# EAGLE design R3D2 (EAGLE 7.4.0)
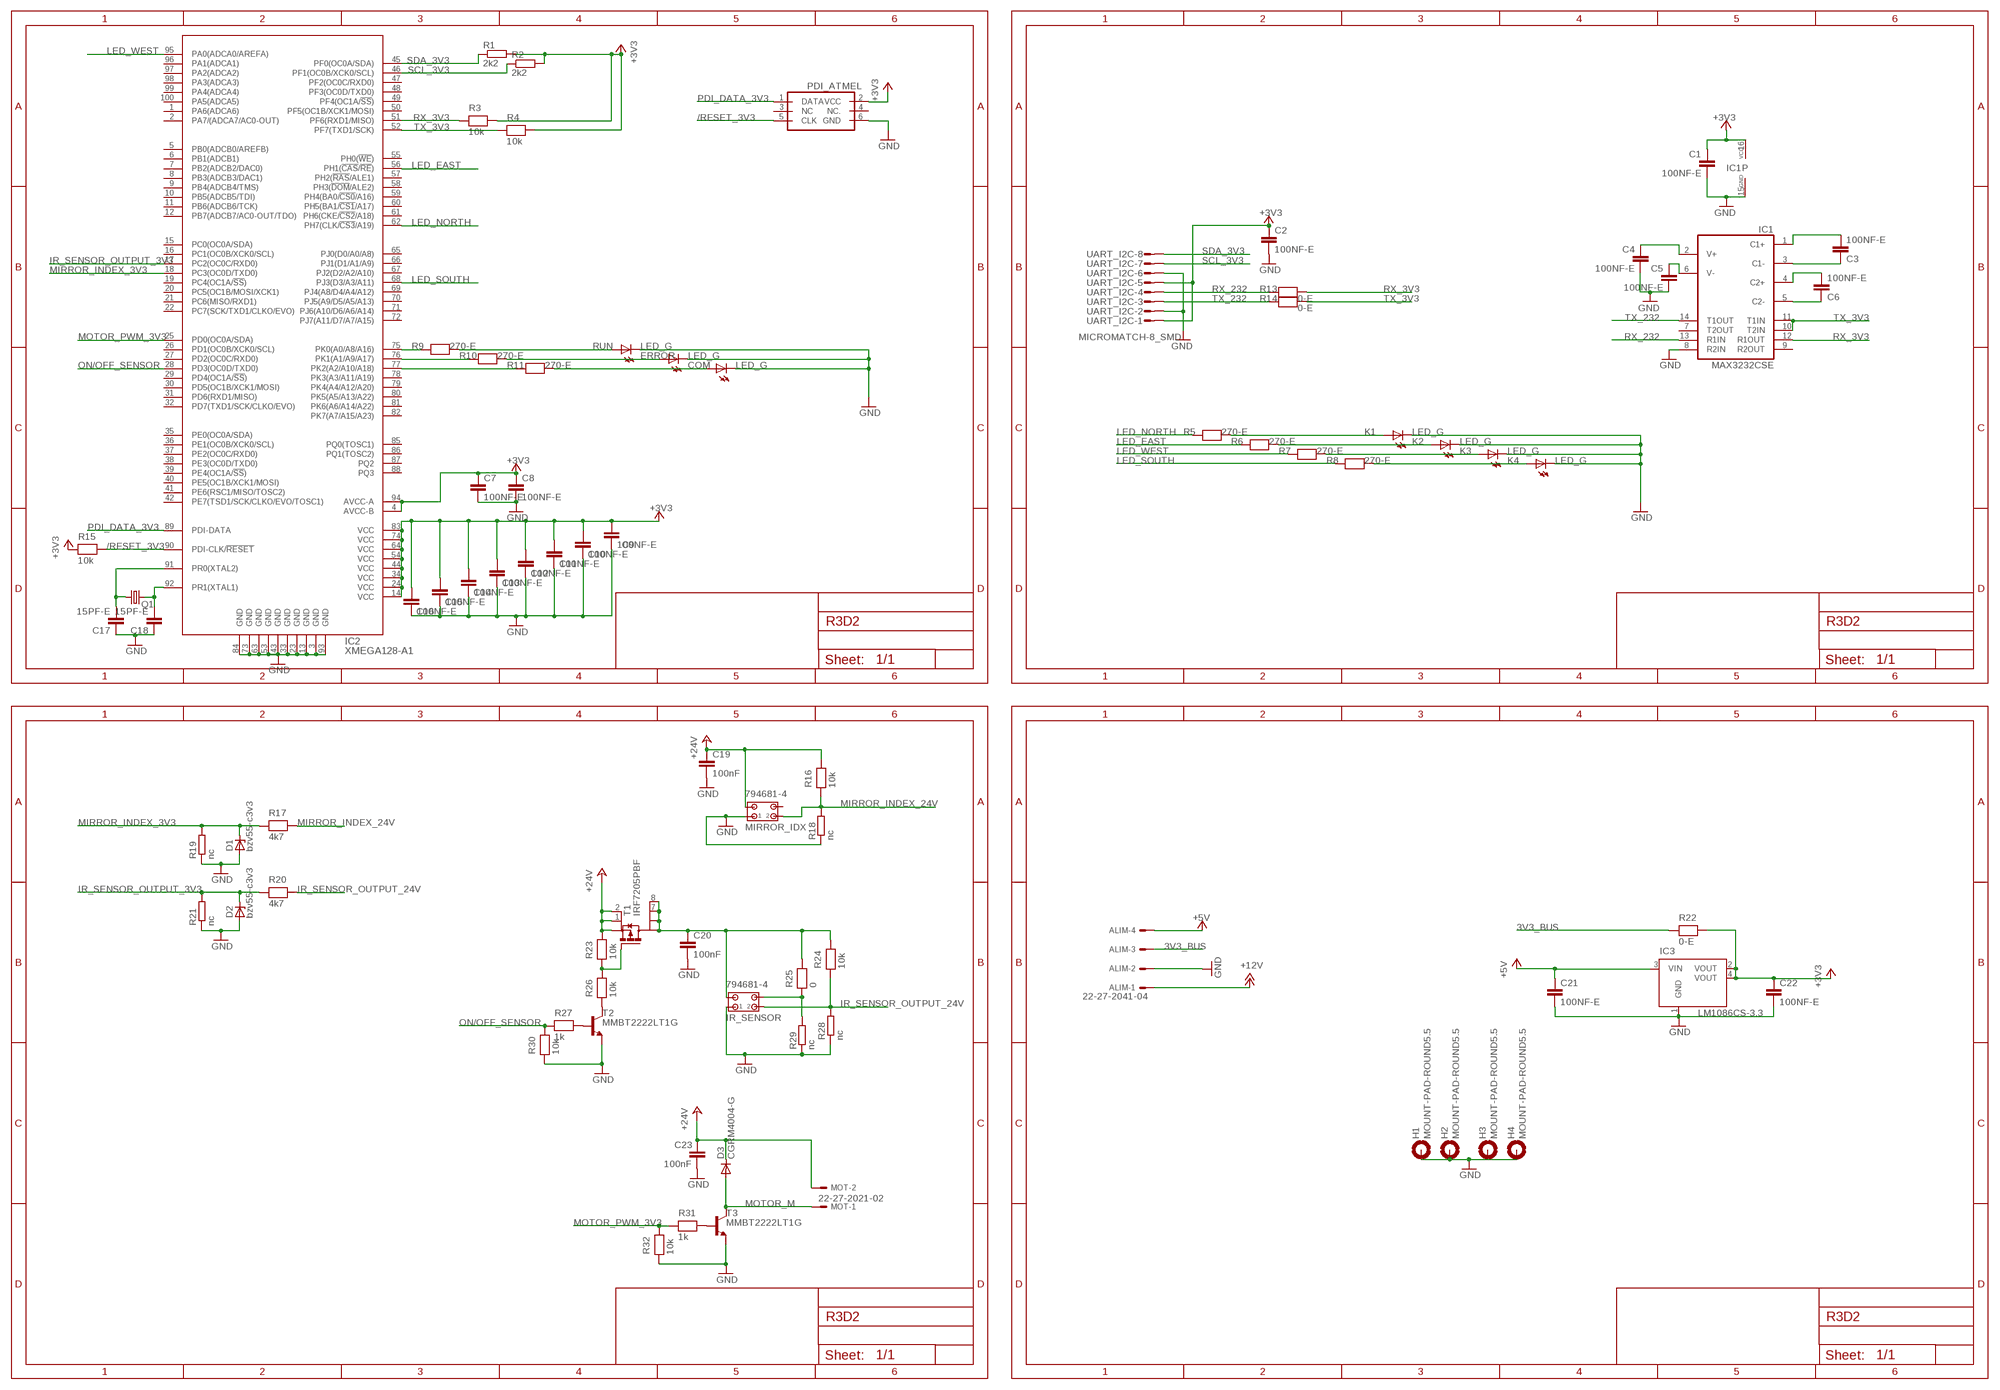
[diagram p0: schematic, sheet 1]

## Parts
ALIM  22-27-2041-04  [6410-04]
C1  100NF-E  [C0805]
C2  100NF-E  [C0805]
C3  100NF-E  [C0805]
C4  100NF-E  [C0805]
C5  100NF-E  [C0805]
C6  100NF-E  [C0805]
C7  100NF-E  [C0805]
C8  100NF-E  [C0805]
C9  100NF-E  [C0805]
C10  100NF-E  [C0805]
C11  100NF-E  [C0805]
C12  100NF-E  [C0805]
C13  100NF-E  [C0805]
C14  100NF-E  [C0805]
C15  100NF-E  [C0805]
C16  100NF-E  [C0805]
C17  15PF-E  [C0805]
C18  15PF-E  [C0805]
C19  100nF  100NF-E  [C0805]
C20  100nF  100NF-F  [C0603]
C21  100NF-E  [C0805]
C22  100NF-E  [C0805]
C23  100nF  100NF-E  [C0805]
COM  LED_G  [CHIP-LED0805]
D1  bzv55-c3v3  BZV55-C3V3SOD80C  [SOD80C]
D2  bzv55-c3v3  BZV55-C3V3SOD80C  [SOD80C]
D3  CGRM4004-G  [SOD-123_MINI-SMA]
ERROR  LED_G  [CHIP-LED0805]
H1  MOUNT-PAD-ROUND5.5  [5,5-PAD]
H2  MOUNT-PAD-ROUND5.5  [5,5-PAD]
H3  MOUNT-PAD-ROUND5.5  [5,5-PAD]
H4  MOUNT-PAD-ROUND5.5  [5,5-PAD]
IC1  MAX3232CSE  [SO16]
IC2  XMEGA128-A1  XMEGA-A1TQFP  [TQFP100]
IC3  LM1086CS-3.3  [TO263]
IR_SENSOR  794681-4  [794681-4]
K1  LED_G  [CHIP-LED0805]
K2  LED_G  [CHIP-LED0805]
K3  LED_G  [CHIP-LED0805]
K4  LED_G  [CHIP-LED0805]
MIRROR_IDX  794681-4  [794681-4]
MOT  22-27-2021-02  [6410-02]
PDI_ATMEL  PDI_ATMEL  [ML6]
Q1  CRYSTAL_16MHZ_HC49UP  [HC49UP]
R1  2k2  R-EU_R0603  [R0603]
R2  2k2  R-EU_R0603  [R0603]
R3  10k  10K-F  [R0603]
R4  10k  10K-F  [R0603]
R5  270-E  [R0805]
R6  270-E  [R0805]
R7  270-E  [R0805]
R8  270-E  [R0805]
R9  270-E  [R0805]
R10  270-E  [R0805]
R11  270-E  [R0805]
R13  0-E  [R0805]
R14  0-E  [R0805]
R15  10k  10K-F  [R0603]
R16  10k  10K-F  [R0603]
R17  4k7  4K7-E  [R0805]
R18  nc  R-EU_R0805  [R0805]
R19  nc  R-EU_R0603  [R0603]
R20  4k7  4K7-E  [R0805]
R21  nc  R-EU_R0603  [R0603]
R22  0-E  [R0805]
R23  10k  10K-F  [R0603]
R24  10k  10K-F  [R0603]
R25  0  0-F  [R0603]
R26  10k  10K-F  [R0603]
R27  1k  1K-F  [R0603]
R28  nc  R-EU_R0603  [R0603]
R29  nc  R-EU_R0603  [R0603]
R30  10k  10K-F  [R0603]
R31  1k  1K-F  [R0603]
R32  10k  10K-F  [R0603]
RUN  LED_G  [CHIP-LED0805]
T1  IRF7205PBF  [SO8]
T2  MMBT2222LT1G  MMBT2222ALT1-NPN-SOT23-BEC  [SOT23-BEC]
T3  MMBT2222LT1G  MMBT2222ALT1-NPN-SOT23-BEC  [SOT23-BEC]
UART_I2C  MICROMATCH-8_SMD  [MICROMATCH-8_SMD]

## Nets
3V3_BUS: ALIM.3 R22.1
+3V3: C1.1 C2.1 C7.1 C8.1 C9.1 C10.1 C11.1 C12.1 C13.1 C14.1 C15.1 C16.1 C22.1 IC1.16(VCC) IC2.4(AVCC-B) IC2.14(VCC) IC2.24(VCC) IC2.34(VCC) IC2.44(VCC) IC2.54(VCC) IC2.64(VCC) IC2.74(VCC) IC2.83(VCC) IC2.94(AVCC-A) IC3.2(VOUT) IC3.4(VOUT) PDI_ATMEL.2(VCC) R1.2 R2.2 R3.2 R4.2 R15.1 R22.2 UART_I2C.1 UART_I2C.5
+5V: ALIM.4 C21.1 IC3.3(VIN)
+12V: ALIM.1
+24V: C19.1 C23.1 D3.C MIRROR_IDX.3 MOT.2 R16.2 R23.2 T1.1(S) T1.2(S) T1.3(S)
/RESET_3V3: IC2.90(PDI-CLK/!RESET) PDI_ATMEL.5(CLK) R15.2
GND: ALIM.2 C1.2 C2.2 C4.2 C5.2 C7.2 C8.2 C9.2 C10.2 C11.2 C12.2 C13.2 C14.2 C15.2 C16.2 C17.1 C18.1 C19.2 C20.2 C21.2 C22.2 C23.2 COM.C D1.A D2.A ERROR.C H1.B5,5(MOUNT) H2.B5,5(MOUNT) H3.B5,5(MOUNT) H4.B5,5(MOUNT) IC1.8(R2IN) IC1.15(GND) IC2.3(GND) IC2.13(GND) IC2.23(GND) IC2.33(GND) IC2.43(GND) IC2.53(GND) IC2.63(GND) IC2.73(GND) IC2.84(GND) IC2.93(GND) IC3.1(GND) IR_SENSOR.1 K1.C K2.C K3.C K4.C MIRROR_IDX.1 PDI_ATMEL.6(GND) R18.1 R19.1 R21.1 R28.1 R29.1 R30.1 R32.1 RUN.C T2.E T3.E UART_I2C.2 UART_I2C.6
IR_SENSOR_OUTPUT_3V3: D2.C IC2.17(PC2(OC0C/RXD0)) R20.1 R21.2
IR_SENSOR_OUTPUT_24V: IR_SENSOR.2 R20.2 R24.1 R28.2
LED_EAST: IC2.56(PH1(!CAS!/!RE!)) R6.1
LED_NORTH: IC2.62(PH7(CLK/!CS3!/A19)) R5.1
LED_SOUTH: IC2.68(PJ3(D3/A3/A11)) R8.1
LED_WEST: IC2.95(PA0(ADCA0/AREFA)) R7.1
MIRROR_INDEX_3V3: D1.C IC2.18(PC3(OC0D/TXD0)) R17.1 R19.2
MIRROR_INDEX_24V: MIRROR_IDX.2 R16.1 R17.2 R18.2
MOTOR_M: D3.A MOT.1 T3.C
MOTOR_PWM_3V3: IC2.25(PD0(OC0A/SDA)) R31.1 R32.2
N$1: C3.1 IC1.1(C1+)
N$2: R9.2 RUN.A
N$3: R31.2 T3.B
N$4: ERROR.A R10.2
N$5: C3.2 IC1.3(C1-)
N$6: C6.1 IC1.4(C2+)
N$7: COM.A R11.2
N$9: IC2.75(PK0(A0/A8/A16)) R9.1
N$10: IC2.76(PK1(A1/A9/A17)) R10.1
N$11: C4.1 IC1.2(V+)
N$12: IC2.77(PK2(A2/A10/A18)) R11.1
N$13: C5.1 IC1.6(V-)
N$24: C6.2 IC1.5(C2-)
N$45: C17.2 IC2.91(PR0(XTAL2)) Q1.1
N$46: C18.2 IC2.92(PR1(XTAL1)) Q1.2
N$91: K1.A R5.2
N$92: K2.A R6.2
N$93: K3.A R7.2
N$94: K4.A R8.2
N$113: R27.2 T2.B
N$125: C20.1 IR_SENSOR.3 R24.2 R25.2 T1.5(D) T1.6(D) T1.7(D) T1.8(D)
N$126: R26.1 T2.C
N$128: R23.1 R26.2 T1.4(G)
N$129: IR_SENSOR.4 R25.1 R29.2
ON/OFF_SENSOR: IC2.28(PD3(OC0D/TXD0)) R27.1 R30.2
PDI_DATA_3V3: IC2.89(PDI-DATA) PDI_ATMEL.1(DATA)
RX_3V3: IC1.12(R1OUT) IC2.51(PF6(RXD1/MISO)) R3.1 R13.2
RX_232: IC1.13(R1IN) R13.1 UART_I2C.4
SCL_3V3: IC2.46(PF1(OC0B/XCK0/SCL)) R2.1 UART_I2C.7
SDA_3V3: IC2.45(PF0(OC0A/SDA)) R1.1 UART_I2C.8
TX_3V3: IC1.10(T2IN) IC1.11(T1IN) IC2.52(PF7(TXD1/SCK)) R4.1 R14.2
TX_232: IC1.14(T1OUT) R14.1 UART_I2C.3
Unconnected: IC1.7(T2OUT) IC1.9(R2OUT) IC2.1(PA6(ADCA6)) IC2.2(PA7/(ADCA7/AC0-OUT)) IC2.5(PB0(ADCB0/AREFB)) IC2.6(PB1(ADCB1)) IC2.7(PB2(ADCB2/DAC0)) IC2.8(PB3(ADCB3/DAC1)) IC2.9(PB4(ADCB4/TMS)) IC2.10(PB5(ADCB5/TDI)) IC2.11(PB6(ADCB6/TCK)) IC2.12(PB7(ADCB7/AC0-OUT/TDO)) IC2.15(PC0(OC0A/SDA)) IC2.16(PC1(OC0B/XCK0/SCL)) IC2.19(PC4(OC1A/!SS!)) IC2.20(PC5(OC1B/MOSI/XCK1)) IC2.21(PC6(MISO/RXD1)) IC2.22(PC7(SCK/TXD1/CLKO/EVO)) IC2.26(PD1(OC0B/XCK0/SCL)) IC2.27(PD2(OC0C/RXD0)) IC2.29(PD4(OC1A/!SS!)) IC2.30(PD5(OC1B/XCK1/MOSI)) IC2.31(PD6(RXD1/MISO)) IC2.32(PD7(TXD1/SCK/CLKO/EVO)) IC2.35(PE0(OC0A/SDA)) IC2.36(PE1(OC0B/XCK0/SCL)) IC2.37(PE2(OC0C/RXD0)) IC2.38(PE3(OC0D/TXD0)) IC2.39(PE4(OC1A/!SS!)) IC2.40(PE5(OC1B/XCK1/MOSI)) IC2.41(PE6(RSC1/MISO/TOSC2)) IC2.42(PE7(TSD1/SCK/CLKO/EVO/TOSC1)) IC2.47(PF2(OC0C/RXD0)) IC2.48(PF3(OC0D/TXD0)) IC2.49(PF4(OC1A/!SS!)) IC2.50(PF5(OC1B/XCK1/MOSI)) IC2.55(PH0(!WE!)) IC2.57(PH2(!RAS!/ALE1)) IC2.58(PH3(!DOM!/ALE2)) IC2.59(PH4(BA0/!CS0!/A16)) IC2.60(PH5(BA1/!CS1!/A17)) IC2.61(PH6(CKE/!CS2!/A18)) IC2.65(PJ0(D0/A0/A8)) IC2.66(PJ1(D1/A1/A9)) IC2.67(PJ2(D2/A2/A10)) IC2.69(PJ4(A8/D4/A4/A12)) IC2.70(PJ5(A9/D5/A5/A13)) IC2.71(PJ6(A10/D6/A6/A14)) IC2.72(PJ7(A11/D7/A7/A15)) IC2.78(PK3(A3/A11/A19)) IC2.79(PK4(A4/A12/A20)) IC2.80(PK5(A5/A13/A22)) IC2.81(PK6(A6/A14/A22)) IC2.82(PK7(A7/A15/A23)) IC2.85(PQ0(TOSC1)) IC2.86(PQ1(TOSC2)) IC2.87(PQ2) IC2.88(PQ3) IC2.96(PA1(ADCA1)) IC2.97(PA2(ADCA2)) IC2.98(PA3(ADCA3)) IC2.99(PA4(ADCA4)) IC2.100(PA5(ADCA5)) MIRROR_IDX.4 PDI_ATMEL.3(NC) PDI_ATMEL.4(NC.)

## Library data of the parts
ALIM = robotter_connector:22-?-04: CONNECTOR wire to board 2.54 mm (.1 inch) pitch header; OC_FARNELL: unknown; OC_NEWARK: unknown
C1-C16 C19 C21-C23 = robotter_capacitor:100NF; MOUSER: 81-GRM40Y104Z50D; RS: 220-7966; VALUE: 100nF 50V
C17 C18 = robotter_capacitor:15PF; VALUE: 15pF_0603_100V
C20 = robotter_capacitor:100NF; MOUSER: 81-GRM188F51H104ZA01; RS: 723-5534; VALUE: 100nF 50V
COM ERROR K1-K4 RUN = robotter_diode:LED_; MOUSER: 859-LTST-C171GKT; RS: 692-0935; VALUE: GREEN
D1 D2 = robotter_diode:BZV55-C3V3: Z-Diode; MOUSER: 771-BZV55-C3V3T/R; RS: 748-5029
D3 = robotter_diode:CGRM400*-G: Molded plasitc,JEDEC SOD-123/Mini SMA Source: Comchip CGRM4001-G.pdf; MOUSER: 863-MRA4004T3G; RS: 545-2456; VALUE: MRA4004T3G
H1-H4 = holes:MOUNT-PAD-ROUND: MOUNTING PAD, round
IC1 = robotter_ic:MAX3232: True RS-232 Transceivers 3.0V to 5.5V, Low-Power up to 1Mbps, Using Four 0.1µF External Capacitors Source: http://pdfserv.maxim-ic.com/en/ds/MAX3222-MAX3241.pdf; MOUSER: 511-ST3232CDR; RS: 415-2105
IC2 = avr-7:XMEGA-A1: Atmel XMega A1 Series processor
IC3 = robotter_ic:LM1086CS-3.3; MOUSER: 926-LM1086CS-3.3NOPB; RS: 533-9426
IR_SENSOR MIRROR_IDX = robotter_connector:794681-4: Micro MATE-N-LOK Connectors grid 1.5mm Dual Row Through Hole Vertical Metal Through Hole Holddowns Source: ENG_CD_794681_E.pdf; MOUSER: 571-3-794630-4; RS: 495-9344; VALUE: 794630-4
MOT = robotter_connector:22-?-02: CONNECTOR wire to board 2.54 mm (.1 inch) pitch header; MOUSER: 538-22-27-2021; RS: 483-8461
PDI_ATMEL = robotter_connector:PDI_ATMEL: Ref Harting : 09 18 506 7323 Atmel pdi connector; MOUSER: 617-09185066323
Q1 = robotter_ic:CRYSTAL_: CRYSTAL; MOUSER: 559-FOXSD160-20-LF; RS: 547-6531; VALUE: 16 MHz
R1 R2 R18 R19 R21 R28 R29 = rcl:R-EU_: RESISTOR, European symbol
R3 R4 R15 R16 R23 R24 R26 R30 R32 = robotter_resistor:10K; MOUSER: 652-CR0603-JW-103ELF; RS: 740-8899
R5-R11 = robotter_resistor:270; MOUSER: 660-RK73H2ATTD2700F; RS: 740-9019
R13 R14 R22 R25 = robotter_resistor:0
R17 R20 = robotter_resistor:4K7; MOUSER: 71-CRCW0805-4.7K-E3; RS: 223-0528
R27 R31 = robotter_resistor:1K; MOUSER: 71-CRCW0603-1.0K-E3; RS: 213-2266
T1 = robotter_ic:IRF7205PBF; RS: 542-9327
T2 T3 = robotter_ic:*-NPN-: NPN Transistror; MOUSER: 863-MMBT2222ALT1G; RS: 544-9400; VALUE: mmbt2222
UART_I2C = robotter_connector:MICROMATCH-8_SMD: Ref FN : 1865096

## Board
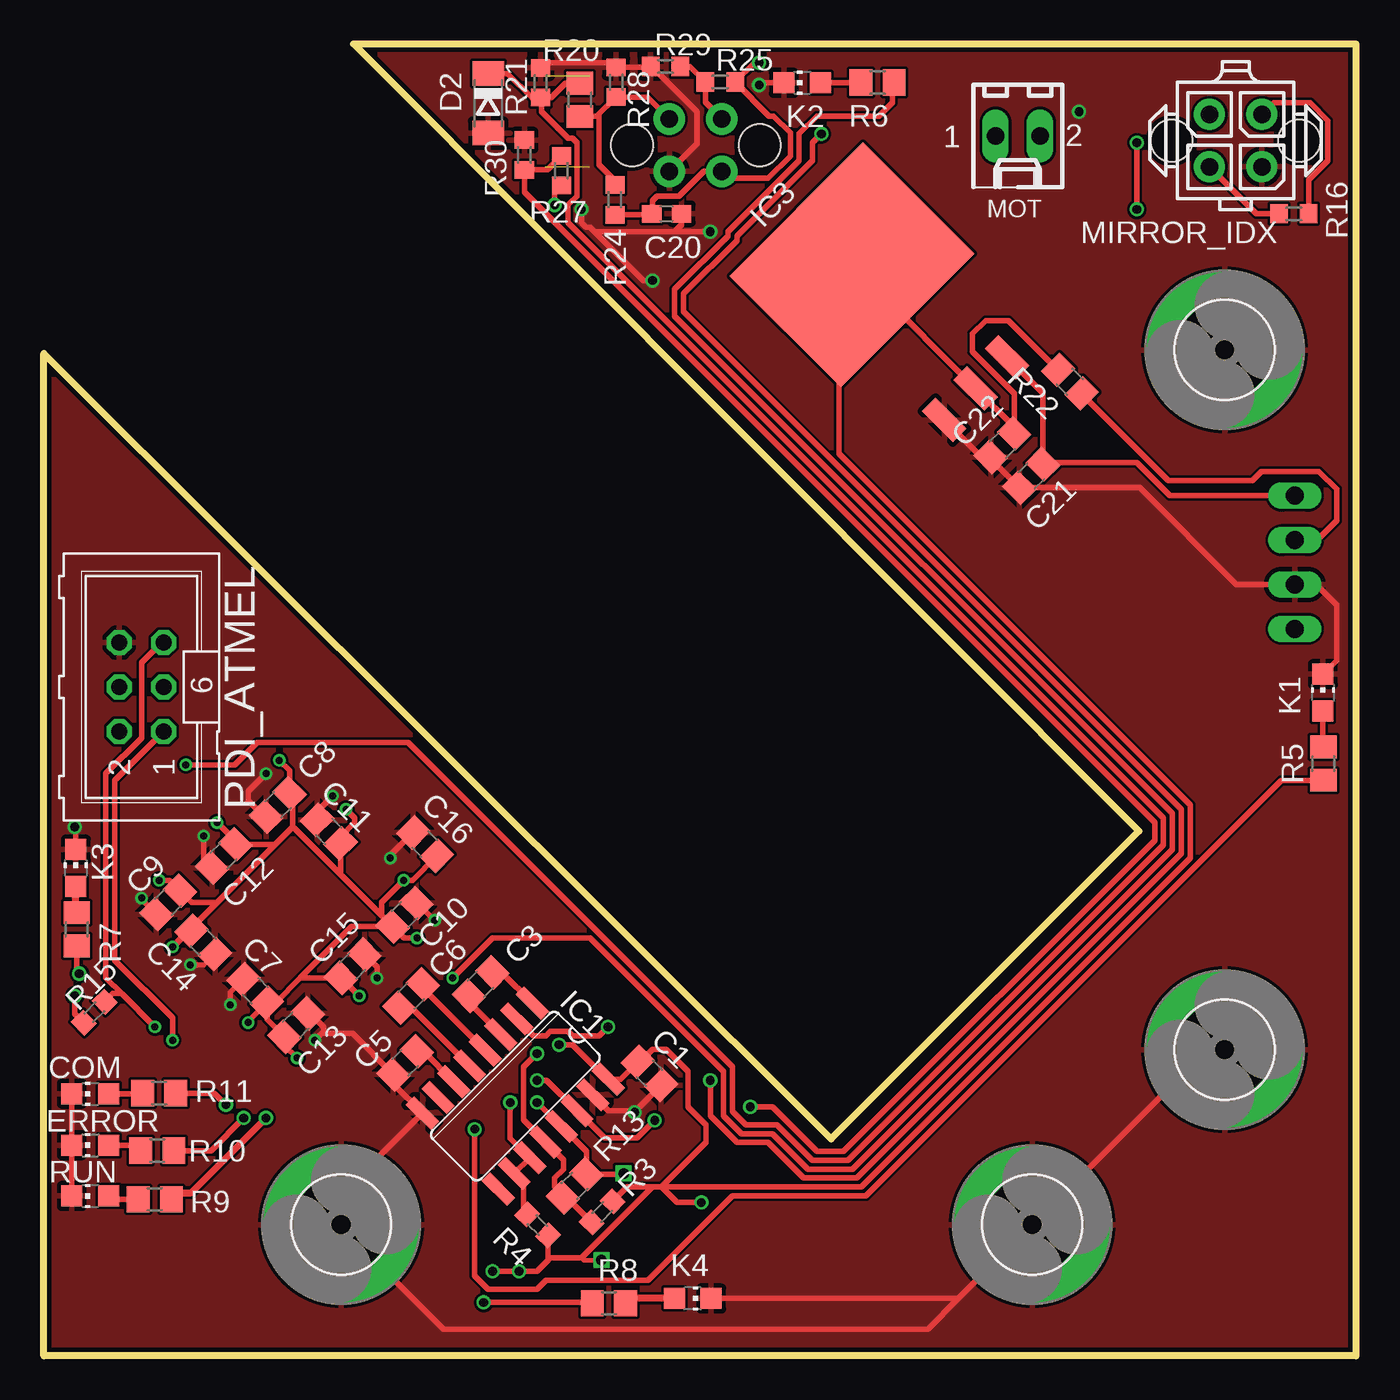
[diagram p1: board, top side]
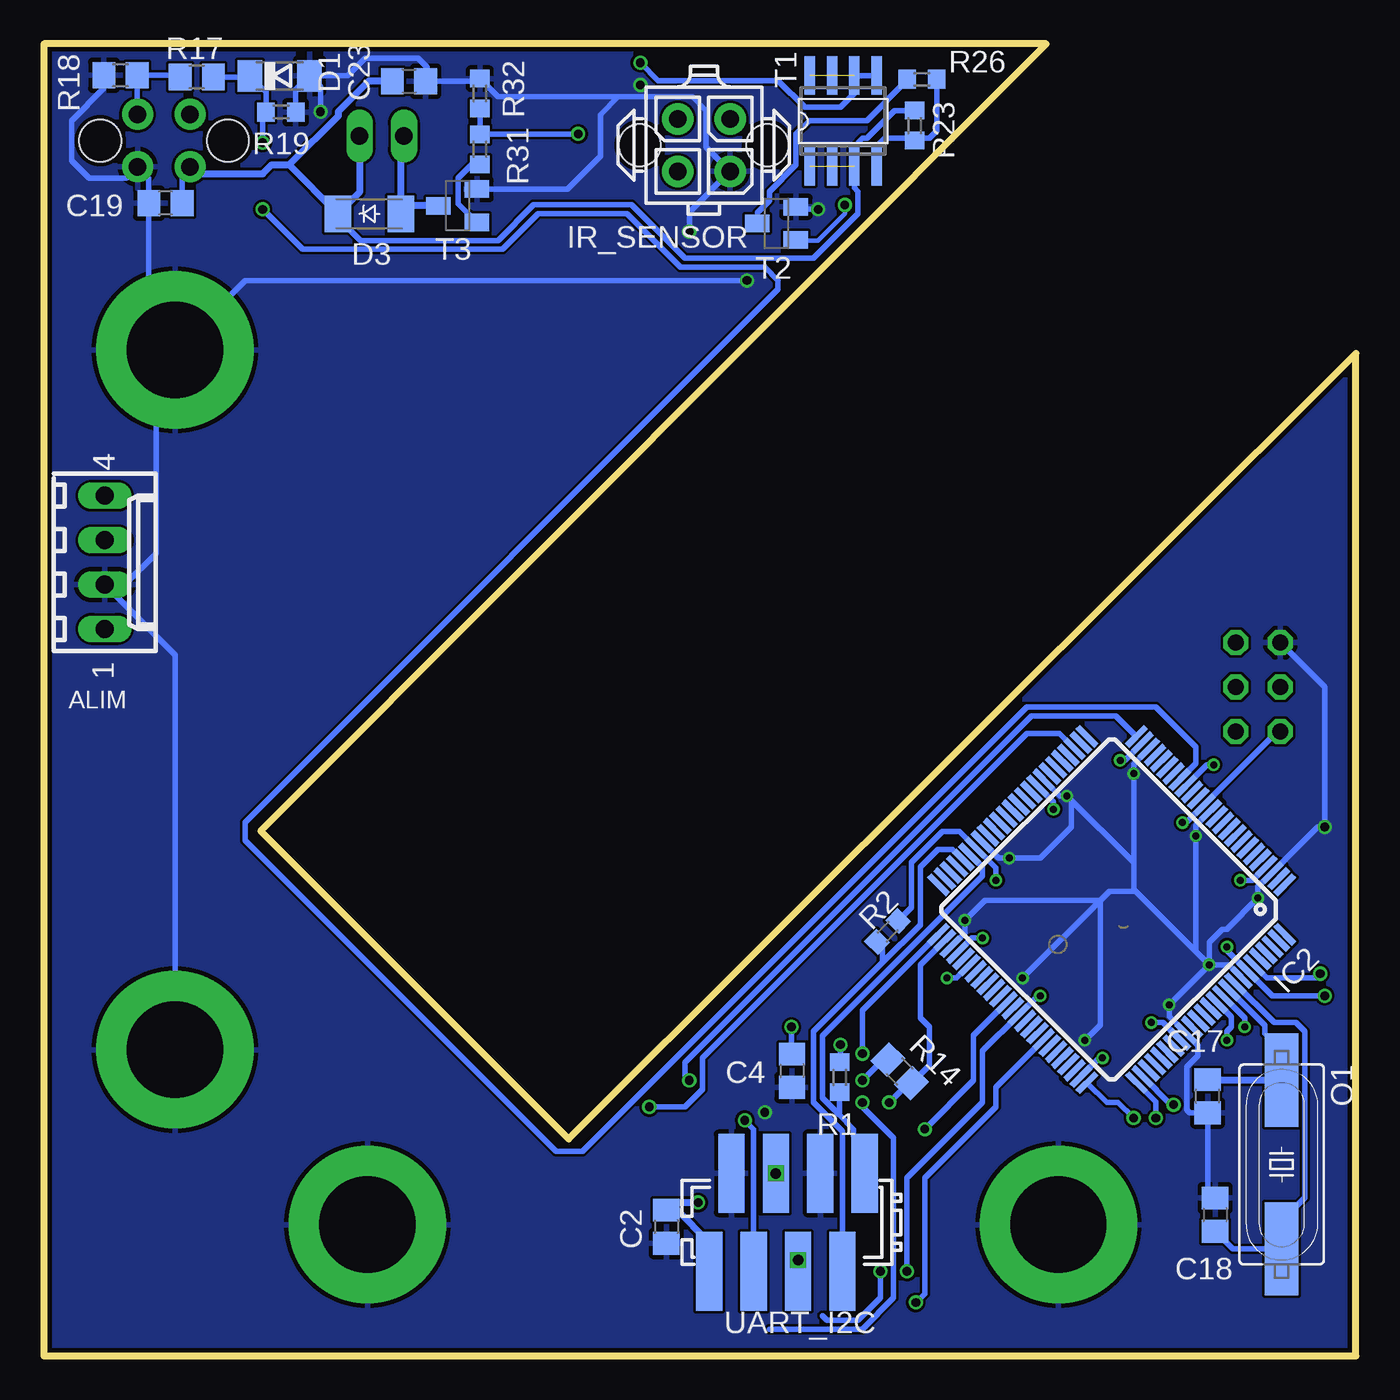
[diagram p2: board, bottom side, seen from below]

Size 75 x 75 mm. Coordinates in mm from the lower left corner, seen from the top.
Outline: 59.69,0 75,0
Outline: 75,0 75,75 17.7,75 62.6,30 45,12.4 0,57.3 0,0 75,0
Copper layers (1*16): Top 0.035mm / dielectric 1.5mm / Bottom 0.035mm
Design rules "Fusion_eagle_rule_v1.1 *": minimum track width 6mil, minimum drill 12mil, track to track 6mil, track to pad 6mil, pad to pad 6mil, via to via 6mil, smd to smd 0mil, copper to edge 10mil, drill to drill 10mil, minimum pad ring 10mil, minimum via ring 6mil, stop-mask expansion 2mil, vias tented up to drill 100mil, thermal gap 10mil

### Footprints (pad centres in the part's own frame; a part is rotated, then mirrored left to right if it is on the bottom)
6410-04 = drill 1.016 long: 1 3.81,0; 2 1.27,0; 3 -1.27,0; 4 -3.81,0
C0805 = smd 1.3 x 1.5: 1 -0.95,0; 2 0.95,0
C0603 = smd 1.1 x 1: 1 -0.85,0; 2 0.85,0
CHIP-LED0805 = smd 1.2 x 1.2: A 0,-1.05; C 0,1.05
SOD80C = smd 1.4 x 1.8: A 1.7,0; C -1.7,0
SOD-123_MINI-SMA = smd 1.5 x 2.1: A 1.8,0; C -1.8,0
5,5-PAD = drill 5.5 pad 9: B5,5 0,0
SO16 = smd 0.66 x 2.032: 1 -4.445,-3.073; 2 -3.175,-3.073; 3 -1.905,-3.073; 4 -0.635,-3.073; 5 0.635,-3.073; 6 1.905,-3.073; 7 3.175,-3.073; 8 4.445,-3.073; 9 4.445,3.073; 10 3.175,3.073; 11 1.905,3.073; 12 0.635,3.073; 13 -0.635,3.073; 14 -1.905,3.073; 15 -3.175,3.073; 16 -4.445,3.073
TQFP100 = smd 1.5 x 0.347: 1 -8,6; 2 -8,5.5; 3 -8,5; 4 -8,4.5; 5 -8,4; 6 -8,3.5; 7 -8,3; 8 -8,2.5; 9 -8,2; 10 -8,1.5; 11 -8,1; 12 -8,0.5; 13 -8,0; 14 -8,-0.5; 15 -8,-1; 16 -8,-1.5; 17 -8,-2; 18 -8,-2.5; 19 -8,-3; 20 -8,-3.5; 21 -8,-4; 22 -8,-4.5; 23 -8,-5; 24 -8,-5.5; 25 -8,-6; 51 8,-6; 52 8,-5.5; 53 8,-5; 54 8,-4.5; 55 8,-4; 56 8,-3.5; 57 8,-3; 58 8,-2.5; 59 8,-2; 60 8,-1.5; 61 8,-1; 62 8,-0.5; 63 8,0; 64 8,0.5; 65 8,1; 66 8,1.5; 67 8,2; 68 8,2.5; 69 8,3; 70 8,3.5; 71 8,4; 72 8,4.5; 73 8,5; 74 8,5.5; 75 8,6 | smd 0.347 x 1.5: 26 -6,-8; 27 -5.5,-8; 28 -5,-8; 29 -4.5,-8; 30 -4,-8; 31 -3.5,-8; 32 -3,-8; 33 -2.5,-8; 34 -2,-8; 35 -1.5,-8; 36 -1,-8; 37 -0.5,-8; 38 0,-8; 39 0.5,-8; 40 1,-8; 41 1.5,-8; 42 2,-8; 43 2.5,-8; 44 3,-8; 45 3.5,-8; 46 4,-8; 47 4.5,-8; 48 5,-8; 49 5.5,-8; 50 6,-8; 76 6,8; 77 5.5,8; 78 5,8; 79 4.5,8; 80 4,8; 81 3.5,8; 82 3,8; 83 2.5,8; 84 2,8; 85 1.5,8; 86 1,8; 87 0.5,8; 88 0,8; 89 -0.5,8; 90 -1,8; 91 -1.5,8; 92 -2,8; 93 -2.5,8; 94 -3,8; 95 -3.5,8; 96 -4,8; 97 -4.5,8; 98 -5,8; 99 -5.5,8; 100 -6,8
TO263 = smd 1.1 x 2.5: 1 -2.54,-8.15; 2 0,-8.15; 3 2.54,-8.15 | smd 10.8 x 9: 4 0,1.85
794681-4 = drill 1 pad 1.778: 1 1.5,-1.5; 2 1.5,1.5; 3 -1.5,-1.5; 4 -1.5,1.5 | hole 2.4: 3.63,0; -3.67,0
6410-02 = drill 1.016 long: 1 1.27,0; 2 -1.27,0
ML6 = drill 0.914 octagon: 1 -2.54,-1.27; 2 -2.54,1.27; 3 0,-1.27; 4 0,1.27; 5 2.54,-1.27; 6 2.54,1.27
HC49UP = smd 5.334 x 1.93: 1 -4.826,0; 2 4.826,0
R0603 = smd 1 x 1.1: 1 -0.85,0; 2 0.85,0
R0805 = smd 1.3 x 1.5: 1 -0.95,0; 2 0.95,0
SO8 = smd 0.6 x 2.2: 1 -1.905,-2.6; 2 -0.635,-2.6; 3 0.635,-2.6; 4 1.905,-2.6; 5 1.905,2.6; 6 0.635,2.6; 7 -0.635,2.6; 8 -1.905,2.6
SOT23-BEC = smd 1 x 1.4: B -0.95,-1.1; C 0,1.1; E 0.95,-1.1
MICROMATCH-8_SMD = smd 1.5 x 4.5: 1 4.445,2.794; 2 3.175,-2.794; 3 1.905,2.794; 4 0.635,-2.794; 5 -0.635,2.794; 6 -1.905,-2.794; 7 -3.175,2.794; 8 -4.445,-2.794

### Placement (x,y rotation side)
ALIM  71.52,45.35 270 bottom
C1  34.63,16.14 315 top
C2  39.41,7.38 270 bottom
C3  24.97,21.24 225 top
C4  32.22,16.3 270 bottom
C5  20.65,16.75 225 top
C6  21,20.58 225 top
C7  12.09,20.85 135 top
C8  13.38,31.49 225 top
C9  7.1,25.91 225 top
C10  20.62,25.2 45 top
C11  16.3,29.97 135 top
C12  10.29,28.57 225 top
C13  14.42,18.9 45 top
C14  9.12,23.62 315 top
C15  17.66,22.27 45 top
C16  21.79,29.24 135 top
C17  8.47,14.83 90 bottom
C18  8.04,8.07 270 bottom
C19  68.04,65.89 180 bottom
C20  35.6,65.28 0 top
C21  56.44,50.3 225 top
C22  54.81,52.05 225 top
C23  54.12,72.86 0 bottom
COM  2.66,14.97 90 top
D1  61.51,73.17 0 bottom
D2  25.41,71.6 270 top
D3  56.39,65.28 0 bottom
ERROR  2.66,12.04 90 top
H1  67.5,17.5 0 top
H2  56.5,7.5 0 top
H3  67.5,57.5 0 top
H4  17,7.5 0 top
IC1  26.96,14.84 225 top
IC2  13.95,25.51 225 bottom
IC3  47.51,61.05 45 top
IR_SENSOR  37.26,69.2 0 bottom
K1  73.12,37.91 0 top
K2  43.36,72.77 90 top
K3  1.83,27.89 0 top
K4  37.1,3.28 270 top
MIRROR_IDX  68.14,69.46 0 top
MOT  55.68,69.73 180 top
PDI_ATMEL  5.59,38.23 90 top
Q1  4.24,10.94 270 bottom
R1  29.51,15.92 90 bottom
R2  26.76,24.26 45 bottom
R3  31.93,8.22 45 top
R4  28.22,7.47 315 top
R5  73.15,33.85 90 top
R6  47.67,72.79 180 top
R7  1.88,24.37 90 top
R8  32.31,3.01 0 top
R9  6.34,8.95 180 top
R10  6.49,11.72 180 top
R11  6.6,15.01 180 top
R13  30.35,9.71 225 top
R14  26.07,16.26 315 bottom
R15  2.89,19.64 45 top
R16  71.46,65.28 180 top
R17  66.26,73.1 180 bottom
R18  70.61,73.2 0 bottom
R19  61.44,71.09 180 bottom
R20  30.64,71.8 270 top
R21  28.4,72.77 270 top
R22  58.65,55.68 135 top
R23  25.22,70.32 90 bottom
R24  32.65,66.08 270 top
R25  38.67,72.82 0 top
R26  24.8,72.97 0 bottom
R27  29.59,67.74 270 top
R28  32.72,72.81 270 top
R29  35.54,73.7 0 top
R30  27.48,68.64 270 top
R31  50.07,68.96 270 bottom
R32  50.07,72.15 270 bottom
RUN  2.66,9.13 90 top
T1  29.3,70.57 0 bottom
T2  33.11,64.73 90 bottom
T3  51.34,65.74 90 bottom
UART_I2C  32.51,7.63 180 bottom

### Tracks (layer width: path | path; a pad name or v marks a point on that pad's centre or on a via)
3V3_BUS
  Top 0.305: R22.1 64.3,50.04 69.09,50.04 69.6,50.55 72.9,50.55 73.91,49.53 73.91,47.75 72.79,46.62 ALIM.3
+3V3  (via drill 0.4, 0.5, 0.6)
  Top 0.254: 30.73,5.59 30.85,5.47 v31.88,5.47
  Top 0.305: v21.34,23.88 20.6,23.88 C10.1 | v18.03,20.57 17.01,21.6 C15.1 14.67,21.6 | v14.48,17.02 13.75,17.75 C13.1 12.76,19.22 C7.1 | v6.6,27.18 7.18,27.18 C9.1 8.45,25.91 9.91,25.91 | v9.91,30.48 10.96,29.42 C12.1 13.24,29.24 | v13.46,34.04 14.05,33.44 C8.1 14.22,32 14.22,30.23 | v17.27,31.24 17.78,30.73 17.78,30.48 16.97,29.67 C11.1 16.97,27.51 | C16.1 21.07,27.18 v20.57,27.18 19.32,25.92 19.32,25.16 | C10.1 19.32,25.16 | 19.32,25.16 16.97,27.51 | 14.22,30.23 14.25,30.23 16.97,27.51 | 14.22,30.23 13.24,29.24 | 9.91,25.91 13.24,29.24 | C10.1 17.61,24.53 14.67,21.6 | 55.48,53.08 IC3.2 47.42,61.14 | 55.48,53.08 C22.1 | 47.42,61.14 IC3.4 | 55.48,53.08 55.48,55.01 53.09,57.4 53.09,58.42 53.85,59.18 55.15,59.18 R22.2 | 47.42,61.14 47.42,57.83 45.47,55.88 45.47,51.56 65.53,31.5 65.53,28.45 46.74,9.65 35.31,9.65 | 35.31,9.65 34.8,9.65 | v1.78,20.57 1.78,19.55 R15.1 | 34.8,9.65 30.73,5.59 28.96,5.59 28.82,5.46 | 35.31,9.65 37.85,12.19 37.85,13.21 36.83,14.22 36.83,16.26 35.56,17.53 34.8,17.53 34.08,16.81 C1.1 32.96,15.81 IC1.16 31.83,16.26 31.75,16.26 30.23,17.78 v29.46,17.78 | v25.65,4.83 v27.18,4.83 28.19,4.83 28.82,5.46 | R4.2 28.82,5.46 | R3.2 33.36,9.65 34.8,9.65 | 9.91,25.91 8.45,24.45 C14.1 8.32,24.3 8.31,24.31 | C7.1 11.68,19.11 v11.68,19.05 | 14.67,21.6 13.25,20.18 C7.1 | 35.31,9.65 36.2,8.76 v37.59,8.76
  Top 0.406: v7.37,23.37 8.31,24.31
  Bottom 0.254: 32,4.96 31.88,5.09 v31.88,5.46 31.88,5.46 UART_I2C.5
  Bottom 0.305: IC2.54 21.95,23.88 v21.34,23.88 | v18.03,20.57 18.18,20.57 IC2.64 21.34,17.42 21.34,14.48 25.65,10.16 v25.65,4.83 | IC2.74 14.66,17.02 v14.48,17.02 | IC2.83 11.03,19.05 v11.68,19.05 | v7.37,23.37 7.37,23.17 IC2.94 4.77,20.57 v1.78,20.57 | IC2.4 5.92,27.18 v6.6,27.18 | v9.91,30.48 9.69,30.48 IC2.14 4.48,35.69 PDI_ATMEL.2 | IC2.24 13.2,34.04 v13.46,34.04 | IC2.34 17.27,31.66 v17.27,31.24 | v20.57,27.18 20.57,27.89 IC2.44 22.66,29.97 23.62,29.97 25.4,28.19 25.4,25.61 R2.2 | 30.48,2.29 30.23,2.03 28.45,2.03 27.18,3.3 v27.18,4.83 27.31,4.83 | R1.2 29.46,16.82 v29.46,17.78 | 32,4.96 32,5.59 v31.88,5.46 v31.88,5.47
  Bottom 0.406: UART_I2C.1 36.96,6.48 38.81,8.33 C2.1 38.98,8.76 v37.59,8.76
+5V
  Top 0.305: IC3.3 57.11,55.04 C21.1 57.2,51.05 62.48,51.05 64.37,49.16 ALIM.4
+24V  (2 unrouted)
  Top 0.305: R16.2 69.32,65.28 MIRROR_IDX.3
  Bottom 0.305: C19.1 67.09,67.51 MIRROR_IDX.3 | 25.27,71.12 R23.2 26.36,71.17 27.94,69.6 28.19,69.6 28.67,69.12 T1.3 28.67,66.77 28.45,66.55 28.45,65.28 30.99,62.74 38.35,62.74 41.4,65.79 46.99,65.79 49.02,63.75 56.9,63.75 58.19,65.05 D3.C
  Bottom 0.406: MOT.2 56.95,66.51 D3.C 58.19,65.3 60.96,68.07 | C23.1 56.42,72.86 58.17,71.12 58.17,70.87 60.96,68.07 | 60.96,68.07 61.98,68.07 62.48,67.56 66.24,67.56 MIRROR_IDX.3
/RESET_3V3  (via drill 0.4)
  Top 0.305: v6.35,18.8 4.45,20.7 | 4.45,20.7 3.56,21.59 3.56,33.27 5.59,35.31 5.59,39.62 6.73,40.77 PDI_ATMEL.5 | R15.2 3.95,20.7 4.45,20.7
  Bottom 0.305: IC2.90 6.35,19.32 v6.35,18.8
GND  (via drill 0.4, 0.5)
  Top 0.305: v22.35,24.89 21.37,25.88 C10.2 | v19.05,21.59 19.05,22.22 C15.2 | v15.49,18.03 15.88,18.41 | 15.88,18.41 16,18.54 16,18.8 15.22,19.57 C13.2 | v8.38,22.35 9.14,22.35 | v5.59,26.16 5.59,26.08 C9.2 | v9.14,29.72 9.14,28.37 C12.2 | v12.7,33.27 11.68,32.26 11.68,31.75 12.61,30.82 C8.2 | v16.51,32 15.62,31.12 C11.2 | v19.81,28.45 19.81,28.61 C16.2 | R21.1 28.4,73.91 32.46,73.91 R28.1 34.65,73.66 R29.1 34.76,73.7 37.34,71.12 37.34,69.28 IR_SENSOR.1 | C20.2 36.45,64.64 36.07,64.26 | 36.07,64.26 31.5,64.26 | 31.5,64.26 31.24,64.52 30.99,64.52 30.73,64.77 v30.73,65.53 | v38.1,64.26 36.07,64.26 | K2.C 41.02,72.77 v40.89,72.64 | IC3.1 53.59,51.38 C22.2 54.13,51.26 C21.2 62.64,49.62 68.18,44.08 ALIM.2 72.76,44.08 73.91,42.93 73.91,39.75 K1.C | K4.C 52.28,3.28 H2.B5,5 66.5,17.5 H1.B5,5 | H4.B5,5 17,9.23 IC1.8 19.98,15.54 C5.2 17.65,18.41 15.88,18.41 | RUN.C ERROR.C COM.C | v1.78,30.23 1.83,30.17 K3.C | 31.5,64.26 34.29,61.47 v34.8,61.47 | IC1.15 32.29,14.01 33.84,14.01 | 33.84,14.01 C1.2 | 33.84,13.73 33.84,14.01 | 52.32,3.3 50.55,1.52 22.86,1.52 17.02,7.37 | v10.67,20.07 10.67,20.77 11.46,21.55
  Bottom 0.305: IC2.93 7.26,22.35 v8.38,22.35 | IC2.13 9.14,30.32 v9.14,29.72 9.14,23.11 | IC2.43 20.42,28.45 v19.81,28.45 18.03,28.45 16.26,30.23 16.26,31.75 v16.51,32 | v8.38,22.35 v10.67,20.07 10.67,19.4 IC2.84 9.02,17.75 9.02,17.14 9.65,16.51 9.65,14.05 9.49,13.88 C17.1 8.47,9.45 C18.1 | v8.38,22.35 8.38,23.62 7.62,24.38 7.37,24.38 v5.59,26.16 5.59,26.8 IC2.3 2.16,30.23 v1.78,30.23 1.78,38.23 PDI_ATMEL.6 | 9.14,23.11 v8.38,22.35 | IC2.23 12.7,33.83 v12.7,33.27 12.7,28.19 | 12.7,28.19 12.7,26.67 12.57,26.54 | 12.57,26.54 9.14,23.11 | IC2.33 16.91,32 v16.51,32 | v16.51,32 12.7,28.19 | v19.05,21.59 14.61,26.04 | 14.61,26.04 14.1,26.54 12.57,26.54 | IC2.53 22.35,24.18 v22.35,24.89 21.21,26.04 14.61,26.04 | v15.49,18.03 14.61,18.92 14.61,26.04 | D1.A 57.64,73.17 56.64,74.17 53.59,74.17 53.09,73.66 53.09,72.95 C23.2 50.21,72.86 R32.1 49.02,71.96 42.16,71.96 | R19.1 60.59,72.39 D1.A | v30.73,65.53 31.86,65.53 T2.E | v38.1,64.26 38.1,65.36 IR_SENSOR.1 37.15,69.09 37.15,71.18 37.92,71.96 42.16,71.96 | 53.83,4.83 H2.B5,5 | v34.8,61.47 63.5,61.47 67.56,57.4 | H1.B5,5 67.5,40.07 ALIM.2 70.36,44.08 68.58,45.86 68.58,56.42 H3.B5,5 68.99,58.99 C19.2 68.99,67.32 MIRROR_IDX.1 70.29,67.31 72.39,67.31 73.41,68.33 73.41,70.61 71.56,72.46 R18.1 | T3.E 45.07,66.69 43.18,68.58 43.18,70.94 42.16,71.96 | v59.18,71.12 59.18,72.54 D1.A
  other vias: 33.78,13.91
  pour Bottom: -6.1,63.5 8.89,78.49 20.07,78.49 80.52,78.49 85.85,73.15 85.85,8.64 72.14,-5.08 2.03,-5.08 -8.38,5.33 -8.38,61.21 -6.35,63.25
  pour Top: -6.35,62.99 8.13,77.47 78.23,77.47 83.06,72.64 83.06,-2.79 82.04,-3.81 -2.29,-3.81 -6.35,0.25
IR_SENSOR_OUTPUT_3V3  (via drill 0.4)
  Top 0.305: R20.1 29.82,72.75 28.99,71.92 R21.2 27.9,71.92 | 27.9,71.92 27.94,71.88 28.45,71.88 28.45,71.12 29.97,69.6 30.23,69.6 30.48,69.34 30.48,66.29 29.97,65.79 29.97,64.77 64.01,30.73 64.01,29.21 45.97,11.18 43.94,11.18 41.91,13.21 40.13,13.21 39.37,13.97 39.37,16.51 20.83,35.05 12.19,35.05 10.92,33.78 v8.13,33.78 | 27.9,71.92 26.53,73.3 D2.C
  Bottom 0.305: IC2.17 8.51,33.78 v8.13,33.78
IR_SENSOR_OUTPUT_24V
  Top 0.305: IR_SENSOR.2 34.51,71.96 R28.2 | R28.2 31.61,70.85 R20.2 | R28.2 31.75,70.99 31.75,68.07 32.65,67.17 R24.1
LED_EAST  (via drill 0.4)
  Top 0.305: R6.1 48.51,72.68 48.51,71.63 47.75,70.87 44.2,70.87 43.18,69.85 43.18,68.33 39.12,64.26 39.12,64.01 36.07,60.96 36.07,59.44 64.52,30.99 64.52,28.96 46.23,10.67 43.69,10.67 41.66,12.7 39.88,12.7 38.86,13.72 38.86,16.26 31.24,23.88 25.65,23.88 v23.37,21.59
  Bottom 0.305: v23.37,21.59 22.82,21.59 IC2.56
LED_NORTH  (via drill 0.5)
  Top 0.305: R5.1 70.75,32.9 46.99,9.14 39.37,9.14 34.54,4.32 28.7,4.32 28.19,3.81 25.4,3.81 24.64,4.57 v24.64,12.95
  Bottom 0.305: v24.64,12.95 21.84,15.75 21.84,18.32 IC2.62
LED_SOUTH  (via drill 0.5)
  Top 0.305: R8.1 31.03,3.01 30.99,3.05 v25.15,3.05
  Bottom 0.305: v25.15,3.05 24.64,3.56 24.64,10.16 20.57,14.22 20.57,15.35 IC2.68
LED_WEST  (via drill 0.5)
  Top 0.305: R7.1 1.88,21.99 v2.03,21.84
  Bottom 0.305: v2.03,21.84 2.29,21.59 5.08,21.59 IC2.95
MIRROR_INDEX_3V3  (via drill 0.5)
  Top 0.305: v62.48,69.34 v62.48,65.53
  Bottom 0.305: R17.1 63.29,73.1 D1.C 62.29,72.24 R19.2 62.48,70.89 v62.48,69.34 | IC2.18 9.14,33.85 9.14,34.8 11.43,37.08 18.8,37.08 44.2,11.68 45.72,11.68 63.5,29.46 63.5,30.48 33.02,60.96 33.02,61.47 33.78,62.23 38.61,62.23 41.66,65.28 46.74,65.28 48.77,63.25 60.2,63.25 v62.48,65.53
MIRROR_INDEX_24V
  Top 0.305: R16.1 72.31,67.23 73.41,68.33 73.41,70.61 72.39,71.63 70.3,71.63 MIRROR_IDX.2
  Bottom 0.305: R17.2 67.31,73.2 R18.2 69.66,70.99 MIRROR_IDX.2
MOTOR_M
  Bottom 0.406: T3.C 54.59,65.74 D3.A 54.59,69.73 MOT.1
MOTOR_PWM_3V3  (via drill 0.5)
  Top 0.305: v44.45,69.85 43.94,69.34 43.94,68.33 39.62,64.01 39.62,63.75 36.58,60.71 36.58,59.69 65.02,31.24 65.02,28.7 46.48,10.16 43.43,10.16 41.4,12.19 39.62,12.19 38.1,13.72 v38.1,15.75
  Bottom 0.305: R32.2 R31.1 | R31.1 | R31.1 44.48,69.82 v44.45,69.85 | IC2.25 13.7,36.58 18.54,36.58 38.35,16.76 38.35,16 v38.1,15.75
N$1
  Top 0.305: IC1.1 26.18,21.92 C3.1
N$2
  Top 0.305: RUN.A 3.9,8.95 R9.2
N$3
  Bottom 0.305: R31.2 50.51,68.11 51.31,67.31 51.31,65.86 T3.B
N$4
  Top 0.305: R10.2 5.22,12.04 ERROR.A
N$5
  Top 0.305: IC1.3 24.3,20.2 C3.2
N$6
  Top 0.305: IC1.4 21.67,21.03 C6.1
N$7
  Top 0.305: R11.2 5.61,14.97 COM.A
N$9  (via drill 0.5)
  Top 0.305: 7.29,9.33 R9.1
  Top 0.406: 7.29,9.33 8.44,9.33 v12.7,13.59
  Bottom 0.305: IC2.75 14.23,14.48 13.59,14.48 v12.7,13.59
N$10  (via drill 0.5)
  Top 0.305: R10.1 9.56,11.72 v11.43,13.59
  Bottom 0.305: IC2.76 11.43,14.51 v11.43,13.59
N$11  (via drill 0.5)
  Top 0.305: IC1.2 28.01,18.29 28.7,18.29 28.96,18.54 29.97,18.54 30.23,18.29 31.75,18.29 v32.26,18.8
  Bottom 0.305: C4.1 32.26,17.28 v32.26,18.8
N$12  (via drill 0.5)
  Top 0.305: R11.1 9.76,15.01 v10.41,14.35
  Bottom 0.305: IC2.77 10.57,14.35 v10.41,14.35
N$13
  Top 0.305: IC1.6 21.69,17.42 C5.1
N$24
  Top 0.305: IC1.5 21,19.9 C6.2
N$45
  Bottom 0.305: IC2.91 5.21,18.89 5.21,18.41 4.59,17.8 4.54,17.8
  Bottom 0.406: C17.2 4.24,15.78 Q1.1 4.24,17.8 4.54,17.8
N$46
  Bottom 0.254: Q1.2 4.24,7.11
  Bottom 0.305: IC2.92 4.66,19.05 3.43,19.05 2.92,18.54 2.92,9.02 4.24,7.7 4.24,7.11 | Q1.2 7.03,6.11 C18.2
N$91
  Top 0.305: K1.A 73.12,34.83 R5.2
N$92
  Top 0.305: K2.A 46.7,72.77 R6.2
N$93
  Top 0.406: R7.2 1.83,25.32 K3.A
N$94
  Top 0.406: K4.A 33.53,3.28 R8.2
N$113  (via drill 0.5)
  Top 0.305: v29.21,65.79 29.21,66.51 R27.2
  Bottom 0.254: 31.98,63.75 30.73,63.75 29.21,65.28 v29.21,65.79
  Bottom 0.305: 31.98,63.75 T2.B
N$125  (via drill 0.5)  (2 unrouted)
  Top 0.305: R24.2 34.69,65.23 C20.1 34.8,65.33 34.8,66.04 35.05,66.29 36.32,66.29 37.73,67.7 IR_SENSOR.3 39.15,67.31 41.4,67.31 42.67,68.58 42.67,69.92 41.72,70.87 41.47,70.87 R25.2 40.62,73.91 v40.89,73.91
  Bottom 0.305: T1.5 T1.6 28.67,72.17 29.46,71.37 31.5,71.37 33.02,72.9 39.88,72.9 v40.89,73.91
N$126
  Bottom 0.305: R26.1 25.65,72.9 27.94,70.61 31.24,70.61 32,69.85 32,68.07 33.53,66.55 33.53,66.04 34.21,65.36 T2.C
N$128
  Bottom 0.305: T1.4 27.4,69.12 26.92,69.6 25.34,69.6 R23.1 25.09,69.6 24.38,69.6 23.95,70.03 R26.2
N$129
  Top 0.305: IR_SENSOR.4 37.82,71.64 R25.1 | R25.1 37.7,72.93 | R29.2 36.94,73.7 R25.1
ON/OFF_SENSOR  (via drill 0.5)
  Top 0.305: v40.39,14.22 41.66,14.22 44.2,11.68 45.72,11.68 63.5,29.46 63.5,30.48 27.48,66.5 R30.2 28.8,67.79 R27.1
  Bottom 0.305: IC2.28 16.93,35.56 18.8,35.56 37.34,17.02 37.34,15.24 38.35,14.22 v40.39,14.22
PDI_DATA_3V3  (via drill 0.4)
  Top 0.305: v7.37,18.03 7.37,19.3 4.06,22.61 4.06,32.89 PDI_ATMEL.1
  Bottom 0.305: IC2.89 7.11,19.38 7.11,18.8 7.37,18.54 v7.37,18.03
RX_3V3  (via drill 0.5)
  Top 0.305: v28.19,17.27 27.43,16.51 27.43,13.47 IC1.12 29.72,11.19 29.72,10.67 29.21,10.16 29.21,9.65 29.68,9.19 R13.2 29.91,9.04 R3.1
  Bottom 0.305: v28.19,17.27 28.19,19.75 IC2.51
RX_232  (via drill 0.5, 0.6)
  Top 0.305: v28.19,14.48 29.55,13.12 IC1.13 31.02,11.68 R13.1 33.11,10.38 UART_I2C.4
  Bottom 0.305: 33.53,1.52 28.19,1.52 26.42,3.3 26.42,12.45 28.19,14.22 v28.19,14.48 | UART_I2C.4 33.15,11.05 33.15,9.14 33.27,9.02 33.27,10.3 UART_I2C.4
  other vias: 33.15,10.42
SCL_3V3
  Bottom 0.305: IC2.46 23.05,28.96 23.88,28.96 24.89,27.94 24.89,24.64 27.05,22.48 | 27.05,22.48 30.99,18.54 30.99,14.48 29.34,12.83 UART_I2C.7 | R2.1 27.05,23.35 27.05,22.48
SDA_3V3
  Bottom 0.305: IC2.45 21.34,27.95 21.34,27.43 30.48,18.29 30.48,14.73 29.51,13.76 | R1.1 29.51,13.76 | UART_I2C.8 28.07,11.94 28.7,12.57 28.7,12.95 29.51,13.76
TX_3V3  (via drill 0.5)
  Top 0.305: v26.67,14.48 26.67,12.44 IC1.11 IC1.10 27.43,9.88 27.43,8.07 R4.1
  Bottom 0.305: v26.67,14.48 25.56,15.58 R14.2 24.38,16.6 24.38,18.8 24.89,19.3 24.89,22.35 IC2.52
TX_232  (via drill 0.5)
  Top 0.305: v28.19,15.75 28.75,15.75 IC1.14 32.05,12.45 33.91,12.45 v34.92,13.46
  Bottom 0.305: v28.19,15.75 27.02,16.93 R14.1 | UART_I2C.3 34.42,12.95 v34.92,13.46